# EAGLE board ShiftReg (EAGLE 8.5.1)
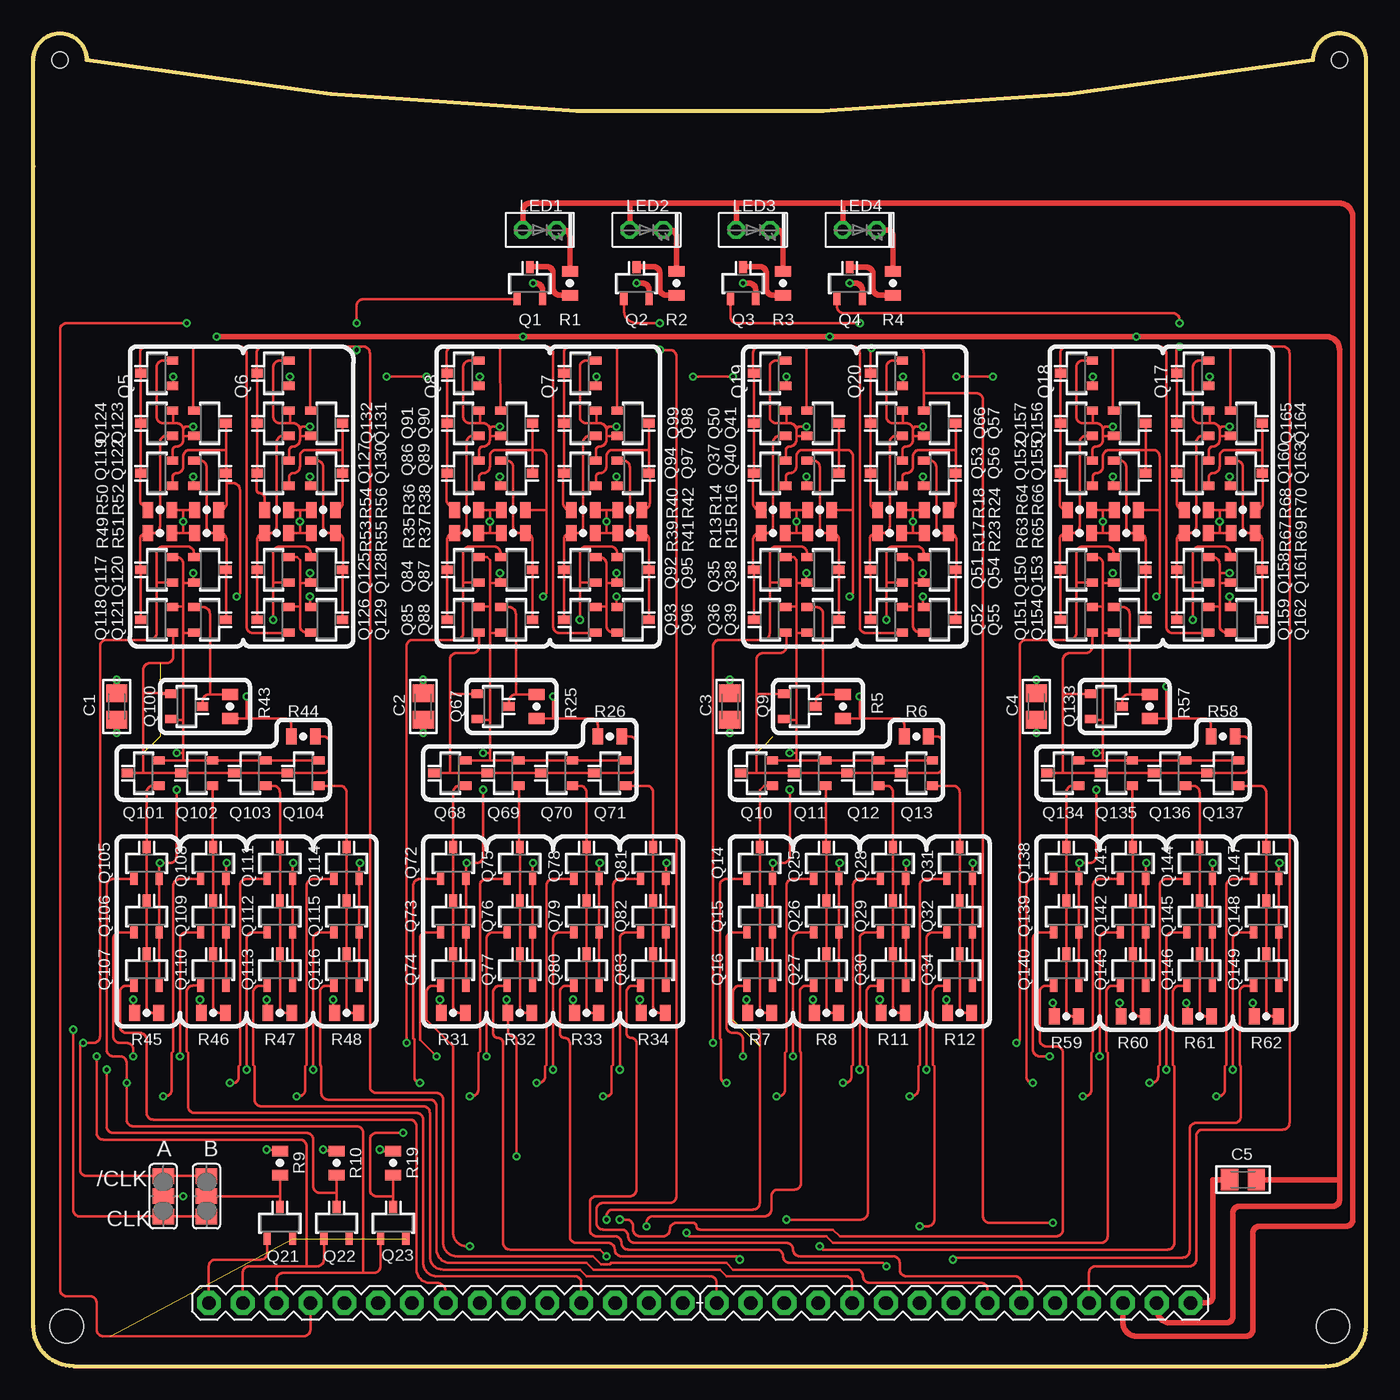
[diagram p2: board, top side]
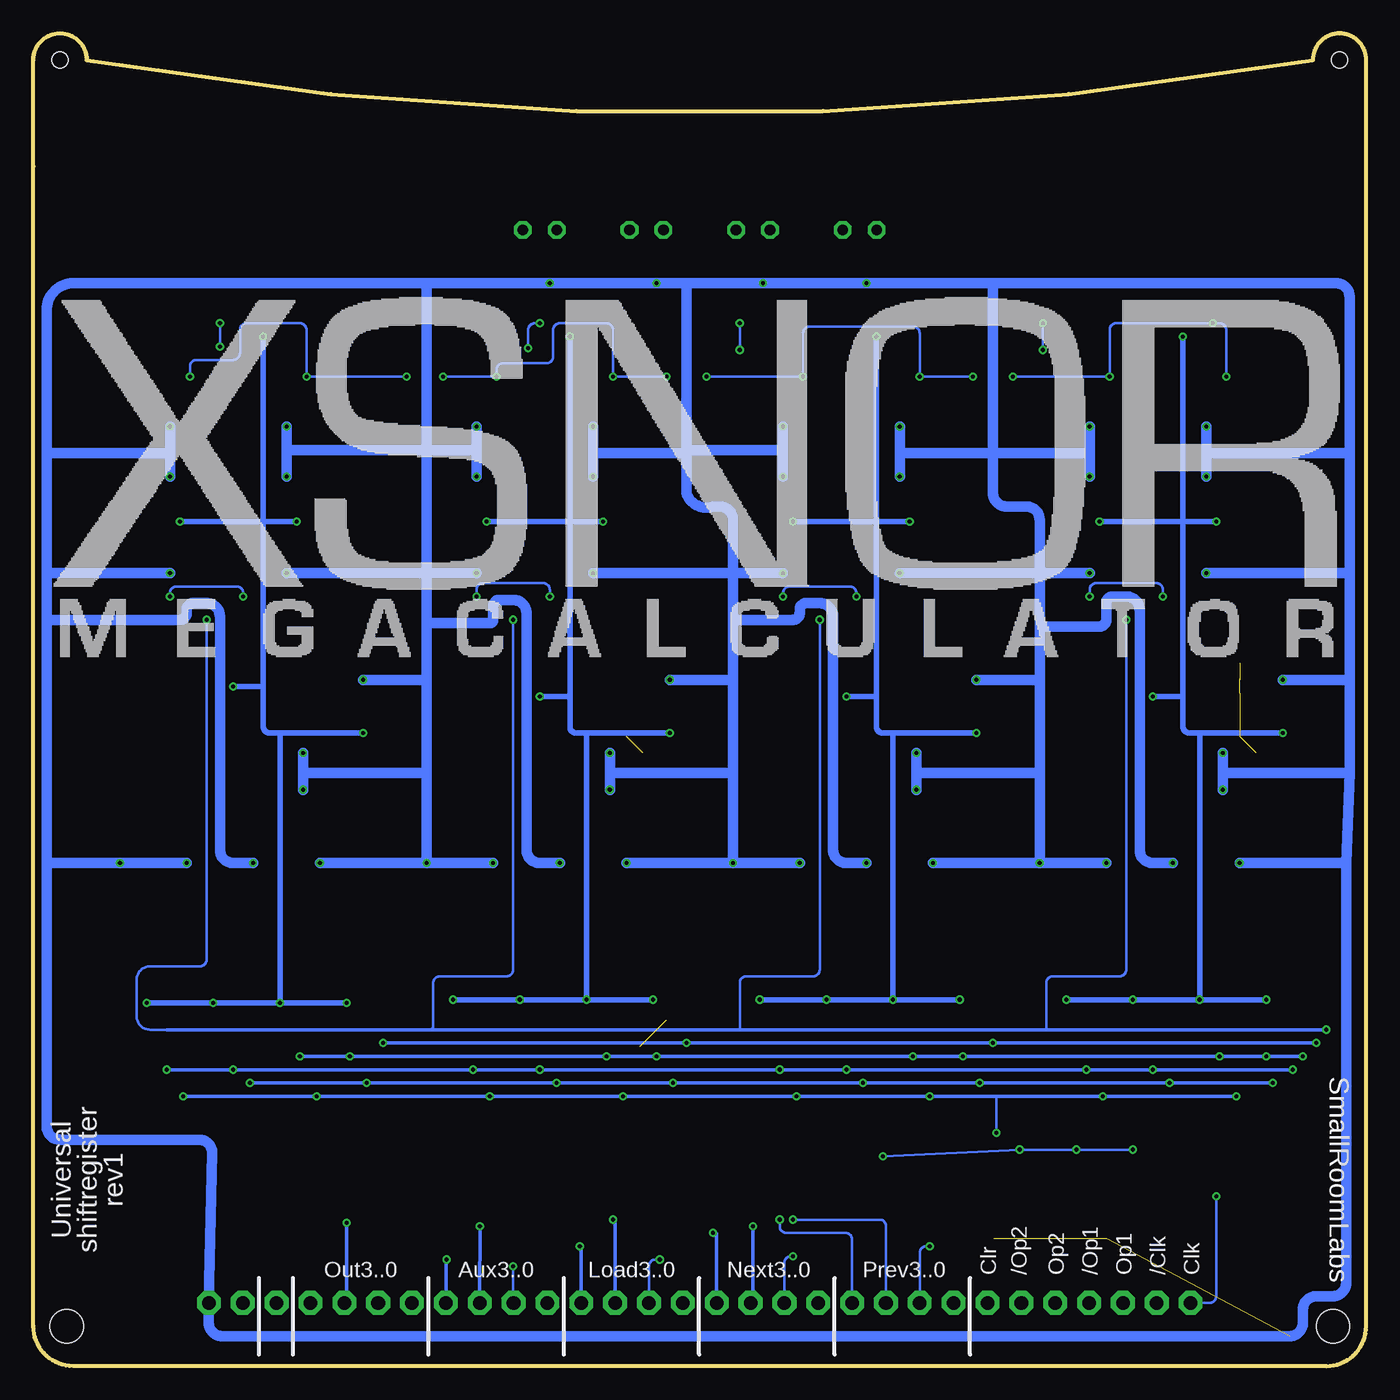
[diagram p3: board, bottom side, seen from below]

Size 100 x 100 mm. Coordinates in mm from the lower left corner, seen from the top.
Outline: 3,0 arc-90 0,3 0,90 0,98 arc-90 2,100 arc-90 4,98 arc20 96,98 arc-90 98,100 arc-90 100,98 100,90 100,3 arc-90 97,0 3,0
Copper layers (1*16): Top 0.035mm / dielectric 1.5mm / Bottom 0.035mm
Design rules "dirt_cheap_dirty_boards.v1": minimum track width 5mil, minimum drill 12mil, track to track 5mil, track to pad 5mil, pad to pad 5mil, via to via 5mil, smd to smd 0mil, copper to edge 10mil, drill to drill 10mil, minimum pad ring 10mil, minimum via ring 6mil, stop-mask expansion 2mil, vias tented up to drill 25mil, thermal gap 10mil
Net classes: 0 default: width 0.2 mm, drill 0.305 mm, clearance 0.2 mm
Holes 2.5 mm at 2.5,3 97.5,3
Holes 1.2 mm at 2,98 98,98

## Footprints (pad centres in the part's own frame; a part is rotated, then mirrored left to right if it is on the bottom)
C0805K = smd 1.3 x 1.6: 1 -1,0; 2 1,0
1X30 = drill 1.016 pad 1.778 octagon: 1 -36.83,0; 2 -34.29,0; 3 -31.75,0; 4 -29.21,0; 5 -26.67,0; 6 -24.13,0; 7 -21.59,0; 8 -19.05,0; 9 -16.51,0; 10 -13.97,0; 11 -11.43,0; 12 -8.89,0; 13 -6.35,0; 14 -3.81,0; 15 -1.27,0; 16 1.27,0; 17 3.81,0; 18 6.35,0; 19 8.89,0; 20 11.43,0; 21 13.97,0; 22 16.51,0; 23 19.05,0; 24 21.59,0; 25 24.13,0; 26 26.67,0; 27 29.21,0; 28 31.75,0; 29 34.29,0; 30 36.83,0
LED2X5 = drill 0.813 octagon: A -1.27,0; K 1.27,0
SOT23 = smd 0.6 x 0.9: 1 -0.95,-1.2; 2 0.95,-1.2 | smd 0.65 x 0.9: 3 0,1.2
0805 = smd 0.8 x 1.2: 1 -0.9,0; 2 0.9,0
SJ_2 = smd 1.168 x 1.6: 1 -1.524,0; 2 0,0; 3 1.524,0

## Placement (x,y rotation side)
C1  [C0805K]  6.25,49.5 90 top
C2  [C0805K]  29.25,49.5 90 top
C3  [C0805K]  52.25,49.5 90 top
C4  [C0805K]  75.25,49.5 90 top
C5  [C0805K]  90.75,14 180 top
JP2  [1X30]  50,4.75 0 top
LED1  [LED2X5]  38,85.25 0 top
LED2  [LED2X5]  46,85.25 0 top
LED3  [LED2X5]  54,85.25 0 top
LED4  [LED2X5]  62,85.25 0 top
Q1  [SOT23]  37.25,81.25 0 top
Q2  [SOT23]  45.25,81.25 0 top
Q3  [SOT23]  53.25,81.25 0 top
Q4  [SOT23]  61.25,81.25 0 top
Q5  310mA/60V/1.6Ω  [SOT23]  9.25,74.5 90 top
Q6  310mA/60V/1.6Ω  [SOT23]  18,74.5 90 top
Q7  310mA/60V/1.6Ω  [SOT23]  41,74.5 90 top
Q8  310mA/60V/1.6Ω  [SOT23]  32.25,74.5 90 top
Q9  310mA/60V/1.6Ω  [SOT23]  57.5,49.5 270 top
Q10  310mA/60V/1.6Ω  [SOT23]  54.25,44.5 90 top
Q11  310mA/60V/1.6Ω  [SOT23]  58.25,44.5 90 top
Q12  310mA/60V/1.6Ω  [SOT23]  62.25,44.5 90 top
Q13  310mA/60V/1.6Ω  [SOT23]  66.25,44.5 90 top
Q14  310mA/60V/1.6Ω  [SOT23]  54.5,37.75 0 top
Q15  310mA/60V/1.6Ω  [SOT23]  54.5,33.75 0 top
Q16  310mA/60V/1.6Ω  [SOT23]  54.5,29.75 0 top
Q17  310mA/60V/1.6Ω  [SOT23]  87,74.5 90 top
Q18  310mA/60V/1.6Ω  [SOT23]  78.25,74.5 90 top
Q19  310mA/60V/1.6Ω  [SOT23]  55.25,74.5 90 top
Q20  310mA/60V/1.6Ω  [SOT23]  64,74.5 90 top
Q21  310mA/60V/1.6Ω  [SOT23]  18.5,10.75 0 top
Q22  310mA/60V/1.6Ω  [SOT23]  22.75,10.75 0 top
Q23  310mA/60V/1.6Ω  [SOT23]  27,10.75 0 top
Q25  310mA/60V/1.6Ω  [SOT23]  59.5,37.75 0 top
Q26  310mA/60V/1.6Ω  [SOT23]  59.5,33.75 0 top
Q27  310mA/60V/1.6Ω  [SOT23]  59.5,29.75 0 top
Q28  310mA/60V/1.6Ω  [SOT23]  64.5,37.75 0 top
Q29  310mA/60V/1.6Ω  [SOT23]  64.5,33.75 0 top
Q30  310mA/60V/1.6Ω  [SOT23]  64.5,29.75 0 top
Q31  310mA/60V/1.6Ω  [SOT23]  69.5,37.75 0 top
Q32  310mA/60V/1.6Ω  [SOT23]  69.5,33.75 0 top
Q34  310mA/60V/1.6Ω  [SOT23]  69.5,29.75 0 top
Q35  310mA/60V/1.6Ω  [SOT23]  55.25,59.75 90 top
Q36  310mA/60V/1.6Ω  [SOT23]  55.25,56 90 top
Q37  310mA/60V/1.6Ω  [SOT23]  55.25,67 90 top
Q38  310mA/60V/1.6Ω  [SOT23]  59.25,59.75 270 top
Q39  310mA/60V/1.6Ω  [SOT23]  59.25,56 270 top
Q40  310mA/60V/1.6Ω  [SOT23]  59.25,67 270 top
Q41  310mA/60V/1.6Ω  [SOT23]  59.25,70.75 270 top
Q50  310mA/60V/1.6Ω  [SOT23]  55.25,70.75 90 top
Q51  310mA/60V/1.6Ω  [SOT23]  64,59.75 90 top
Q52  310mA/60V/1.6Ω  [SOT23]  64,56 90 top
Q53  310mA/60V/1.6Ω  [SOT23]  64,67 90 top
Q54  310mA/60V/1.6Ω  [SOT23]  68,59.75 270 top
Q55  310mA/60V/1.6Ω  [SOT23]  68,56 270 top
Q56  310mA/60V/1.6Ω  [SOT23]  68,67 270 top
Q57  310mA/60V/1.6Ω  [SOT23]  68,70.75 270 top
Q66  310mA/60V/1.6Ω  [SOT23]  64,70.75 90 top
Q67  310mA/60V/1.6Ω  [SOT23]  34.5,49.5 270 top
Q68  310mA/60V/1.6Ω  [SOT23]  31.25,44.5 90 top
Q69  310mA/60V/1.6Ω  [SOT23]  35.25,44.5 90 top
Q70  310mA/60V/1.6Ω  [SOT23]  39.25,44.5 90 top
Q71  310mA/60V/1.6Ω  [SOT23]  43.25,44.5 90 top
Q72  310mA/60V/1.6Ω  [SOT23]  31.5,37.75 0 top
Q73  310mA/60V/1.6Ω  [SOT23]  31.5,33.75 0 top
Q74  310mA/60V/1.6Ω  [SOT23]  31.5,29.75 0 top
Q75  310mA/60V/1.6Ω  [SOT23]  36.5,37.75 0 top
Q76  310mA/60V/1.6Ω  [SOT23]  36.5,33.75 0 top
Q77  310mA/60V/1.6Ω  [SOT23]  36.5,29.75 0 top
Q78  310mA/60V/1.6Ω  [SOT23]  41.5,37.75 0 top
Q79  310mA/60V/1.6Ω  [SOT23]  41.5,33.75 0 top
Q80  310mA/60V/1.6Ω  [SOT23]  41.5,29.75 0 top
Q81  310mA/60V/1.6Ω  [SOT23]  46.5,37.75 0 top
Q82  310mA/60V/1.6Ω  [SOT23]  46.5,33.75 0 top
Q83  310mA/60V/1.6Ω  [SOT23]  46.5,29.75 0 top
Q84  310mA/60V/1.6Ω  [SOT23]  32.25,59.75 90 top
Q85  310mA/60V/1.6Ω  [SOT23]  32.25,56 90 top
Q86  310mA/60V/1.6Ω  [SOT23]  32.25,67 90 top
Q87  310mA/60V/1.6Ω  [SOT23]  36.25,59.75 270 top
Q88  310mA/60V/1.6Ω  [SOT23]  36.25,56 270 top
Q89  310mA/60V/1.6Ω  [SOT23]  36.25,67 270 top
Q90  310mA/60V/1.6Ω  [SOT23]  36.25,70.75 270 top
Q91  310mA/60V/1.6Ω  [SOT23]  32.25,70.75 90 top
Q92  310mA/60V/1.6Ω  [SOT23]  41,59.75 90 top
Q93  310mA/60V/1.6Ω  [SOT23]  41,56 90 top
Q94  310mA/60V/1.6Ω  [SOT23]  41,67 90 top
Q95  310mA/60V/1.6Ω  [SOT23]  45,59.75 270 top
Q96  310mA/60V/1.6Ω  [SOT23]  45,56 270 top
Q97  310mA/60V/1.6Ω  [SOT23]  45,67 270 top
Q98  310mA/60V/1.6Ω  [SOT23]  45,70.75 270 top
Q99  310mA/60V/1.6Ω  [SOT23]  41,70.75 90 top
Q100  310mA/60V/1.6Ω  [SOT23]  11.5,49.5 270 top
Q101  310mA/60V/1.6Ω  [SOT23]  8.25,44.5 90 top
Q102  310mA/60V/1.6Ω  [SOT23]  12.25,44.5 90 top
Q103  310mA/60V/1.6Ω  [SOT23]  16.25,44.5 90 top
Q104  310mA/60V/1.6Ω  [SOT23]  20.25,44.5 90 top
Q105  310mA/60V/1.6Ω  [SOT23]  8.5,37.75 0 top
Q106  310mA/60V/1.6Ω  [SOT23]  8.5,33.75 0 top
Q107  310mA/60V/1.6Ω  [SOT23]  8.5,29.75 0 top
Q108  310mA/60V/1.6Ω  [SOT23]  13.5,37.75 0 top
Q109  310mA/60V/1.6Ω  [SOT23]  13.5,33.75 0 top
Q110  310mA/60V/1.6Ω  [SOT23]  13.5,29.75 0 top
Q111  310mA/60V/1.6Ω  [SOT23]  18.5,37.75 0 top
Q112  310mA/60V/1.6Ω  [SOT23]  18.5,33.75 0 top
Q113  310mA/60V/1.6Ω  [SOT23]  18.5,29.75 0 top
Q114  310mA/60V/1.6Ω  [SOT23]  23.5,37.75 0 top
Q115  310mA/60V/1.6Ω  [SOT23]  23.5,33.75 0 top
Q116  310mA/60V/1.6Ω  [SOT23]  23.5,29.75 0 top
Q117  310mA/60V/1.6Ω  [SOT23]  9.25,59.75 90 top
Q118  310mA/60V/1.6Ω  [SOT23]  9.25,56 90 top
Q119  310mA/60V/1.6Ω  [SOT23]  9.25,67 90 top
Q120  310mA/60V/1.6Ω  [SOT23]  13.25,59.75 270 top
Q121  310mA/60V/1.6Ω  [SOT23]  13.25,56 270 top
Q122  310mA/60V/1.6Ω  [SOT23]  13.25,67 270 top
Q123  310mA/60V/1.6Ω  [SOT23]  13.25,70.75 270 top
Q124  310mA/60V/1.6Ω  [SOT23]  9.25,70.75 90 top
Q125  310mA/60V/1.6Ω  [SOT23]  18,59.75 90 top
Q126  310mA/60V/1.6Ω  [SOT23]  18,56 90 top
Q127  310mA/60V/1.6Ω  [SOT23]  18,67 90 top
Q128  310mA/60V/1.6Ω  [SOT23]  22,59.75 270 top
Q129  310mA/60V/1.6Ω  [SOT23]  22,56 270 top
Q130  310mA/60V/1.6Ω  [SOT23]  22,67 270 top
Q131  310mA/60V/1.6Ω  [SOT23]  22,70.75 270 top
Q132  310mA/60V/1.6Ω  [SOT23]  18,70.75 90 top
Q133  310mA/60V/1.6Ω  [SOT23]  80.5,49.5 270 top
Q134  310mA/60V/1.6Ω  [SOT23]  77.25,44.5 90 top
Q135  310mA/60V/1.6Ω  [SOT23]  81.25,44.5 90 top
Q136  310mA/60V/1.6Ω  [SOT23]  85.25,44.5 90 top
Q137  310mA/60V/1.6Ω  [SOT23]  89.25,44.5 90 top
Q138  310mA/60V/1.6Ω  [SOT23]  77.5,37.75 0 top
Q139  310mA/60V/1.6Ω  [SOT23]  77.5,33.75 0 top
Q140  310mA/60V/1.6Ω  [SOT23]  77.5,29.75 0 top
Q141  310mA/60V/1.6Ω  [SOT23]  82.5,37.75 0 top
Q142  310mA/60V/1.6Ω  [SOT23]  82.5,33.75 0 top
Q143  310mA/60V/1.6Ω  [SOT23]  82.5,29.75 0 top
Q144  310mA/60V/1.6Ω  [SOT23]  87.5,37.75 0 top
Q145  310mA/60V/1.6Ω  [SOT23]  87.5,33.75 0 top
Q146  310mA/60V/1.6Ω  [SOT23]  87.5,29.75 0 top
Q147  310mA/60V/1.6Ω  [SOT23]  92.5,37.75 0 top
Q148  310mA/60V/1.6Ω  [SOT23]  92.5,33.75 0 top
Q149  310mA/60V/1.6Ω  [SOT23]  92.5,29.75 0 top
Q150  310mA/60V/1.6Ω  [SOT23]  78.25,59.75 90 top
Q151  310mA/60V/1.6Ω  [SOT23]  78.25,56 90 top
Q152  310mA/60V/1.6Ω  [SOT23]  78.25,67 90 top
Q153  310mA/60V/1.6Ω  [SOT23]  82.25,59.75 270 top
Q154  310mA/60V/1.6Ω  [SOT23]  82.25,56 270 top
Q155  310mA/60V/1.6Ω  [SOT23]  82.25,67 270 top
Q156  310mA/60V/1.6Ω  [SOT23]  82.25,70.75 270 top
Q157  310mA/60V/1.6Ω  [SOT23]  78.25,70.75 90 top
Q158  310mA/60V/1.6Ω  [SOT23]  87,59.75 90 top
Q159  310mA/60V/1.6Ω  [SOT23]  87,56 90 top
Q160  310mA/60V/1.6Ω  [SOT23]  87,67 90 top
Q161  310mA/60V/1.6Ω  [SOT23]  91,59.75 270 top
Q162  310mA/60V/1.6Ω  [SOT23]  91,56 270 top
Q163  310mA/60V/1.6Ω  [SOT23]  91,67 270 top
Q164  310mA/60V/1.6Ω  [SOT23]  91,70.75 270 top
Q165  310mA/60V/1.6Ω  [SOT23]  87,70.75 90 top
R1  [0805]  40.25,81.25 90 top
R2  [0805]  48.25,81.25 90 top
R3  [0805]  56.25,81.25 90 top
R4  [0805]  64.5,81.25 90 top
R5  [0805]  60.75,49.5 90 top
R6  [0805]  66.25,47.25 0 top
R7  [0805]  54.5,26.5 0 top
R8  [0805]  59.5,26.5 0 top
R9  [0805]  18.5,15.25 90 top
R10  [0805]  22.75,15.25 90 top
R11  [0805]  64.5,26.5 0 top
R12  [0805]  69.5,26.5 0 top
R13  [0805]  55.5,62.5 0 top
R14  [0805]  55.5,64.25 0 top
R15  [0805]  59,62.5 180 top
R16  [0805]  59,64.25 180 top
R17  [0805]  64.25,62.5 0 top
R18  [0805]  64.25,64.25 0 top
R19  [0805]  27,15.25 90 top
R23  [0805]  67.75,62.5 180 top
R24  [0805]  67.75,64.25 180 top
R25  [0805]  37.75,49.5 90 top
R26  [0805]  43.25,47.25 0 top
R31  [0805]  31.5,26.5 0 top
R32  [0805]  36.5,26.5 0 top
R33  [0805]  41.5,26.5 0 top
R34  [0805]  46.5,26.5 0 top
R35  [0805]  32.5,62.5 0 top
R36  [0805]  32.5,64.25 0 top
R37  [0805]  36,62.5 180 top
R38  [0805]  36,64.25 180 top
R39  [0805]  41.25,62.5 0 top
R40  [0805]  41.25,64.25 0 top
R41  [0805]  44.75,62.5 180 top
R42  [0805]  44.75,64.25 180 top
R43  [0805]  14.75,49.5 90 top
R44  [0805]  20.25,47.25 0 top
R45  [0805]  8.5,26.5 0 top
R46  [0805]  13.5,26.5 0 top
R47  [0805]  18.5,26.5 0 top
R48  [0805]  23.5,26.5 0 top
R49  [0805]  9.5,62.5 0 top
R50  [0805]  9.5,64.25 0 top
R51  [0805]  13,62.5 180 top
R52  [0805]  13,64.25 180 top
R53  [0805]  18.25,62.5 0 top
R54  [0805]  18.25,64.25 0 top
R55  [0805]  21.75,62.5 180 top
R56  [0805]  21.75,64.25 180 top
R57  [0805]  83.75,49.5 90 top
R58  [0805]  89.25,47.25 0 top
R59  [0805]  77.5,26.25 0 top
R60  [0805]  82.5,26.25 0 top
R61  [0805]  87.5,26.25 0 top
R62  [0805]  92.5,26.25 0 top
R63  [0805]  78.5,62.5 0 top
R64  [0805]  78.5,64.25 0 top
R65  [0805]  82,62.5 180 top
R66  [0805]  82,64.25 180 top
R67  [0805]  87.25,62.5 0 top
R68  [0805]  87.25,64.25 0 top
R69  [0805]  90.75,62.5 180 top
R70  [0805]  90.75,64.25 180 top
SJ1  [SJ_2]  13,12.75 90 top
SJ2  [SJ_2]  9.75,12.75 90 top

## Tracks (layer width: path | path; a pad name or v marks a point on that pad's centre or on a via)
/CLK  (via drill 0.3)
  Top 0.2: 74,25.49 74,25.25 | 78.25,58.8 Q150.1 | 55.25,58.8 Q35.1 | 32.25,58.8 Q84.1 | 9.25,58.8 Q117.1 | 32.25,58.8 32.25,61 arc-90 32.75,61.5 34.55,61.5 arc-90 35.05,61 Q87.1 | Q38.1 58.05,61 arc90 57.55,61.5 55.75,61.5 arc90 55.25,61 55.25,58.8 | Q153.1 81.05,61 arc90 80.55,61.5 78.75,61.5 arc90 78.25,61 78.25,58.8 | 9.25,58.8 9.25,61 arc-90 9.75,61.5 11.55,61.5 arc-90 12.05,61 Q120.1 | 9.25,58.8 9.25,55 arc-90 8.75,54.5 5.5,54.5 arc90 5,54 5,24.75 arc-90 4.5,24.25 v3.75,24.25 arc90 3.5,24 3.5,14.77 arc90 4,14.27 SJ2.3 SJ1.3 | v28,24.25 28,54 arc-90 28.5,54.5 31.75,54.5 arc90 32.25,55 32.25,58.8 | v51,24.25 51,54 arc-90 51.5,54.5 54.75,54.5 arc90 55.25,55 55.25,58.8 | 74,25.25 74,54 arc-90 74.5,54.5 77.75,54.5 arc90 78.25,55 78.25,58.8 | 74,25.25 74,24.5 arc-90 v73.75,24.25
  Bottom 0.25: v3.75,24.25 v28,24.25 v51,24.25 v73.75,24.25
/OP1  (via drill 0.3)
  Top 0.2: 67,23.75 67,23.5 | 67,23.75 v67,22.25 | 85,25.64 85,25.5 | 85,25.5 v85,22.25 | v90,22.25 90,25.72 90,24.25 | 90,24.25 90,24.5 | 85,24.25 85,24.5 | 85,25.5 85,24.25 | Q79.1 40.5,32.55 39.5,32.55 arc90 39,32.05 v39,22.25 | Q115.1 22.51,32.55 21.5,32.55 arc90 21,32.05 v21,22.25 | Q112.1 16.5,32.55 arc90 16,32.05 v16,22.25 | Q82.1 44.5,32.55 arc90 44,32.05 v44,22.25 | Q29.1 62.5,32.55 arc90 62,32.05 v62,22.25 | Q32.1 67.5,32.55 arc90 67,32.05 67,23.75 | Q145.1 85.5,32.55 arc90 85,32.05 85,24.25 | Q148.1 90.5,32.55 arc90 90,32.05 90,24.25 | Q22.3 22.75,13 | 22.75,13 R10.1 | v5.5,22.25 5.5,18 arc90 6,17.5 20.5,17.5 arc-90 21,17 21,13.5 arc90 21.5,13 22.75,13
  Bottom 0.25: v5.5,22.25 v16,22.25 v21,22.25 v39,22.25 v44,22.25 v62,22.25 v67,22.25 81.5,22.25 v85,22.25 v90,22.25
/OP2  (via drill 0.3)
  Top 0.2: Q25.1 58.5,36.55 57,36.55 arc90 56.5,36.05 56.5,23.61 56.4,23.5 56.4,23 | Q108.1 11,36.55 arc90 10.5,36.05 10.5,23.61 10.39,23.5 10.39,20.75 arc-90 9.89,20.25 v9.75,20.25 | Q81.1 44,36.55 arc90 43.5,36.05 43.5,22.61 43.4,22.5 43.4,20.64 arc-90 43,20.25 v42.75,20.25 | Q31.1 67,36.55 arc90 66.5,36.05 66.5,22.61 66.39,22.5 66.39,22 | Q141.1 80,36.55 arc90 79.5,36.05 79.5,23.61 79.39,23.5 79.39,23 | Q147.1 90,36.55 arc90 89.5,36.05 89.5,22.61 89.39,22.5 89.39,22 | 33.5,35.5 33.5,34.75 | 33.5,34.75 33.5,23.61 33.4,23.5 33.4,20.75 arc-90 32.9,20.25 v32.75,20.25 | Q75.1 34,36.55 arc90 33.5,36.05 33.5,34.75 | Q23.3 27,12.75 | 27,12.75 27,13 R19.1 | 27,12.75 25.75,12.75 arc-90 25.25,13.25 25.25,17 arc-90 25.75,17.5 v27.75,17.5 | v19.75,20.25 19.89,20.25 arc90 20.39,20.75 20.39,22.5 20.5,22.61 20.5,36.05 arc-90 21,36.55 Q114.1 | 56.4,23 | 56.4,23 56.4,20.75 arc-90 55.9,20.25 v55.75,20.25 | 66.39,22 | 66.39,22 66.39,20.75 arc-90 65.89,20.25 v65.75,20.25 | 79.39,23 | 79.39,23 79.39,20.75 arc-90 78.89,20.25 v78.75,20.25 | 89.39,22 | 89.39,22 89.39,20.75 arc-90 88.89,20.25 v88.75,20.25
  Bottom 0.2: v27.75,17.5 27.75,20 27.75,20.25
  Bottom 0.25: v9.75,20.25 v19.75,20.25 27.75,20.25 v32.75,20.25 v42.75,20.25 v55.75,20.25 v65.75,20.25 v78.75,20.25 v88.75,20.25
AUX0
  Top 0.2: JP2.20 61.43,6.25 arc90 60.93,6.75 52,6.75 51.5,7.25 43.46,7.25 43.43,7.21 42.03,7.21 41.5,7.75 31.25,7.75 arc-90 30.25,8.75 30.25,12.25 | Q116.1 22,28.55 arc90 21.5,28.05 21.5,22.61 21.61,22.5 21.61,20.5 arc90 22.11,20 29.75,20 arc-90 30.25,19.5 30.25,12.25 | 30.25,13.25 30.25,12.25
AUX0A'
  Top 0.2: R48.2 24,26.5 arc-90 23.5,27 Q116.3 Q115.3 Q114.3 23.5,43.05 arc90 23,43.55 Q104.1
AUX1  (via drill 0.3)
  Top 0.2: v64,7.5 63.75,7.75 58.25,7.75 56.75,7.75 arc-90 56.25,8.25 arc90 55.75,8.75 44.62,8.75 arc-90 44.12,9.25 arc90 43.62,9.75 42.25,9.75 arc-90 41.75,10.25 41.75,12.25 arc-90 42.25,12.75 44.75,12.75 arc90 45.25,13.25 45.25,24.25 arc90 44.88,24.62 arc-90 44.5,25 44.5,28.05 arc-90 45,28.55 Q83.1
  Bottom 0.2: v64,7.5 64,4.78 JP2.21
AUX1A'-
  Top 0.2: Q71.1 46,43.55 arc-90 46.5,43.05 Q81.3 Q82.3 Q83.3 46.5,27 arc90 47,26.5 R34.2
AUX2  (via drill 0.3)
  Top 0.2: 67.61,22 67.61,22.5 67.5,22.61 67.5,28.05 arc-90 68,28.55 Q34.1 | 67.61,22 | 67.61,22 67.61,11 arc-90 67.11,10.5 v66.5,10.5
  Bottom 0.25: JP2.22 66.51,5.24 v66.5,10.5
AUX2A'
  Top 0.2: Q13.1 69,43.55 arc-90 69.5,43.05 Q31.3 Q32.3 Q34.3 69.5,27 arc90 70,26.5 R12.2
AUX3  (via drill 0.3)
  Top 0.2: Q149.1 91,28.55 arc90 90.5,28.05 90.5,22.61 90.61,22.5 90.61,22 | 90.61,22 | v69,8 arc-90 69.15,8.15 86.25,8.15 arc90 86.75,8.65 86.75,17.75 arc-90 87.25,18.25 90.11,18.25 arc90 90.61,18.75 90.61,22
  Bottom 0.25: v69,8 69.05,8.2 JP2.23
AUX3A'
  Top 0.2: Q137.1 92,43.55 arc-90 92.5,43.05 Q147.3 Q148.3 Q149.3 92.5,26.75 arc90 93,26.25 R62.2
CLK  (via drill 0.3)
  Top 0.2: 87,58.8 Q158.1 | 87,58.8 v87,56 | 64,58.8 Q51.1 | 64,58.8 v64,56 | 41,58.8 Q92.1 | 41,58.8 v41,56 | 18,58.8 Q125.1 | 18,58.8 v18,56 | Q95.1 43.8,61 arc90 43.3,61.5 41.5,61.5 arc90 41,61 41,58.8 | Q54.1 66.8,61 arc90 66.3,61.5 64.5,61.5 arc90 64,61 64,58.8 | 87,58.8 87,61 arc-90 87.5,61.5 89.3,61.5 arc-90 89.8,61 Q161.1 | SJ1.1 SJ2.1 3.5,11.23 arc-90 3,11.73 v3,25.25 | 18,58.8 18,61 arc-90 18.5,61.5 20.3,61.5 arc-90 20.8,61 Q128.1
  Bottom 0.2: v18,56 18,29.75 arc90 18.5,29.25 23.5,29.25 arc-90 24,28.75 24,26 | 24,26 24,25.25 24,26 | v41,56 41,29.75 arc90 41.5,29.25 46.5,29.25 arc-90 47,28.75 47,25.25 | v64,56 64,29.75 arc90 64.5,29.25 69.5,29.25 arc-90 70,28.75 70,25.75 | 70,25.75 70,25.25 | v87,56 87,30.5 arc90 87.5,30 89.75,30 91.25,30 arc-90 92.25,29 92.25,26.25 arc-90 91.25,25.25 85.25,25.25 | 70,25.75 70,25.5 arc90 70.25,25.25
  Bottom 0.25: v3,25.25 24,25.25 47,25.25 70,25.25 70.25,25.25 85.25,25.25 90,25.25
CLK_IN  (via drill 0.3)
  Top 0.2: JP2.1 13.17,7.5 arc-90 13.67,8 17.05,8 arc90 17.55,8.5 Q21.1 | v11.25,12.75 SJ2.2
  Bottom 0.2: JP2.1 11.75,4.75 arc-90 11.25,5.25 v11.25,12.75
CLR  (via drill 0.3)
  Top 0.2: Q17.1 arc90 88.25,73.6 v88.25,74.25 | v79.5,74.25 79.5,73.6 arc-90 Q18.1 | Q20.1 arc90 65.25,73.6 v65.25,74.25 | v56.5,74.25 56.5,73.6 arc-90 Q19.1 | Q7.1 42.2,74.2 arc-90 v42.25,74.25 | v33.5,74.25 33.5,73.6 arc-90 Q8.1 | Q6.1 arc90 19.25,73.6 v19.25,74.25 | v10.5,74.25 10.5,73.6 arc-90 Q5.1 | v49.5,74.25 v52.5,74.25 | v69.25,74.25 v72,74.25 | v26.5,74.25 v29.5,74.25 | v11.5,78.25 2.5,78.25 arc90 2,77.75 2,5.75 arc90 2.5,5.25 4.25,5.25 arc-90 4.75,4.75 4.75,2.75 arc90 5.25,2.25 20.29,2.25 arc90 20.79,2.75 JP2.4
  Bottom 0.2: v88.25,74.25 88.25,75 arc90 87.75,75.5 85,75.5 arc-90 84.5,76 84.5,77.75 arc90 84,78.25 80,78.25 arc90 79.5,77.75 v79.5,74.25 v72,74.25 | v10.5,74.25 10.5,77.75 arc-90 11,78.25 v11.5,78.25 18.75,78.25 arc-90 19.25,77.75 v19.25,74.25 v26.5,74.25 | v49.5,74.25 v42.25,74.25 42.25,77.5 arc90 41.75,78 34,78 arc90 33.5,77.5 v33.5,74.25 v29.5,74.25 | v52.5,74.25 v56.5,74.25 56.5,77.75 arc-90 57,78.25 60.5,78.25 arc-90 61,77.75 61,75.75 arc90 61.5,75.25 64.75,75.25 arc-90 65.25,74.75 v65.25,74.25 v69.25,74.25
GND  (via drill 0.3)  (3 unrouted)
  Top 0.2: C4.2 v75.25,51.5 | Q134.2 80.25,45.45 | 80.25,45.45 Q135.2 Q136.2 Q137.2 | 80.25,48.5 80.25,46 | 80.25,46 80.25,45.45 | 80.25,58.75 80.25,57 | 80.25,58.75 81,58.75 Q153.2 81,58.85 | Q151.2 79.5,57 80.25,57 | 79.5,68 Q152.2 79.45,68.7 arc-90 79.75,69 arc90 80.25,69.5 80.25,69.75 | 80.25,55 80.25,57 | Q155.2 81,66.1 v81,66.75 | 81,69.85 Q156.2 80.3,69.8 arc90 80.25,69.75 | 89,58.75 89,57 | 89,58.75 89.75,58.75 Q161.2 89.75,58.85 | Q159.2 88.25,57 89,57 | Q163.2 89.75,66.1 v89.75,66.75 | 89.75,69.85 Q164.2 89.05,69.8 arc90 89,69.75 | Q154.2 81,55 80.25,55 | Q133.2 79.35,48.5 80.25,48.5 | 80.25,48.5 80.25,55 | Q140.2 Q139.2 Q138.2 78.45,37.7 v78.5,37.75 79.25,37.75 arc90 79.75,38.25 v79.75,43.25 | Q143.2 Q142.2 Q141.2 83.45,37.7 v83.5,37.75 | Q146.2 Q145.2 Q144.2 88.45,37.7 v88.5,37.75 | Q149.2 Q148.2 Q147.2 93.45,37.7 v93.5,37.75 | v79.75,46 80.25,46 | Q10.2 57.25,45.45 | 57.25,45.45 Q11.2 Q12.2 Q13.2 | 57.25,48.5 57.25,46 | 57.25,46 57.25,45.45 | 57.25,58.75 57.25,57 | 57.25,58.75 58,58.75 Q38.2 58,58.85 v58,59.5 | Q36.2 56.5,57 57.25,57 | 57.25,58.75 57.25,60.5 57.05,60.7 Q35.2 | 57.25,69.75 57.3,69.8 Q41.2 58,69.85 | 57.25,55 57.25,57 | Q40.2 58,66.1 v58,66.75 | 66,58.75 66,57 | 66,58.75 66.75,58.75 Q54.2 66.75,58.85 v66.75,59.5 | Q52.2 65.25,57 66,57 | 65.25,68 Q53.2 65.2,68.7 arc-90 65.5,69 arc90 66,69.5 66,69.75 | Q56.2 66.75,66.1 v66.75,66.75 | 66.75,69.85 Q57.2 66.05,69.8 arc90 66,69.75 | Q39.2 58,55 57.25,55 | Q9.2 56.35,48.5 57.25,48.5 | 57.25,48.5 57.25,55 | Q16.2 Q15.2 Q14.2 55.45,37.7 v55.5,37.75 56.25,37.75 arc90 56.75,38.25 v56.75,43.25 | Q27.2 Q26.2 Q25.2 60.45,37.7 v60.5,37.75 | Q30.2 Q29.2 Q28.2 65.45,37.7 v65.5,37.75
  Top 0.2: Q34.2 Q32.2 Q31.2 70.45,37.7 v70.5,37.75 | v56.75,46 57.25,46 | Q68.2 34.25,45.45 | 34.25,45.45 Q69.2 Q70.2 Q71.2 | 34.25,48.5 34.25,46 | 34.25,46 34.25,45.45 | 34.25,58.75 34.25,57 | 34.25,58.75 35,58.75 Q87.2 35,58.85 v35,59.5 | Q85.2 33.5,57 34.25,57 | 34.25,58.75 34.25,60.5 34.05,60.7 Q84.2 | 33.5,68 Q86.2 33.45,68.7 arc-90 33.75,69 arc90 34.25,69.5 34.25,69.75 | 34.25,55 34.25,57 | Q89.2 35,66.1 v35,66.75 | 35,69.85 Q90.2 34.3,69.8 arc90 34.25,69.75 | 43,58.75 43,57 | 43,58.75 43.75,58.75 Q95.2 43.75,58.85 v43.75,59.5 | Q93.2 42.25,57 43,57 | 42.25,68 Q94.2 42.2,68.7 arc-90 42.5,69 arc90 43,69.5 43,69.75 | Q97.2 43.75,66.1 v43.75,66.75 | 43.75,70 43.75,69.85 Q98.2 43.05,69.8 arc90 43,69.75 | Q88.2 35,55 34.25,55 | Q67.2 33.35,48.5 34.25,48.5 | 34.25,48.5 34.25,55 | Q74.2 Q73.2 Q72.2 32.45,37.7 v32.5,37.75 33.25,37.75 arc90 33.75,38.25 v33.75,43.25 | Q77.2 Q76.2 Q75.2 37.45,37.7 v37.5,37.75 | Q80.2 Q79.2 Q78.2 42.45,37.7 v42.5,37.75 | Q83.2 Q82.2 Q81.2 47.45,37.7 v47.5,37.75 | v33.75,46 34.25,46 | Q101.2 11.25,45.45 | 11.25,45.45 Q102.2 Q103.2 Q104.2 | 11.25,48.5 11.25,46 | 11.25,46 11.25,45.45 | 11.25,58.75 11.25,57 | 11.25,58.75 12,58.75 Q120.2 12,58.85 v12,59.5 | Q118.2 10.5,57 11.25,57 | 10.5,68 Q119.2 10.45,68.7 arc-90 10.75,69 arc90 11.25,69.5 11.25,69.75 | 11.25,55 11.25,57 | Q122.2 12,66.1 v12,66.75 | 12,69.85 Q123.2 11.3,69.8 arc90 11.25,69.75 | Q129.2 20.5,55.05 arc-90 20,55.55 20,57 | 20,58.75 20,57 | 20,58.75 20.75,58.75 Q128.2 20.75,58.85 v20.75,59.5 | Q126.2 19.25,57 20,57 | 20,58.75 20,60.5 19.8,60.7 Q125.2 | 19.25,68 Q127.2 19.2,68.7 arc-90 19.5,69 arc90 20,69.5 20,69.75 | Q130.2 20.75,66.1 v20.75,66.75
  Top 0.2: 20.75,69.85 Q131.2 20.05,69.8 arc90 20,69.75 | Q121.2 12,55 11.25,55 | Q100.2 10.35,48.5 11.25,48.5 | 11.25,48.5 11.25,55 | Q107.2 Q106.2 Q105.2 9.45,37.7 v9.5,37.75 10.25,37.75 arc90 10.75,38.25 v10.75,43.25 | Q110.2 Q109.2 Q108.2 14.45,37.7 v14.5,37.75 | Q113.2 Q112.2 Q111.2 19.45,37.7 v19.5,37.75 | Q116.2 Q115.2 Q114.2 24.45,37.7 v24.5,37.75 | v10.75,46 11.25,46 | Q96.2 43.5,55.05 arc-90 43,55.55 43,57 | Q92.2 42.5,60.7 arc-90 43,60.2 43,58.75 | Q55.2 66.5,55.05 arc-90 66,55.55 66,57 | Q51.2 65.5,60.7 arc-90 66,60.2 66,58.75 | Q162.2 89.5,55.05 arc-90 89,55.55 89,57 | 11.25,58.75 11.25,60.2 arc90 10.75,60.7 Q117.2 | Q5.2 9.75,75.45 arc90 9.25,74.95 9.25,71.75 9.25,71.25 arc90 9.75,70.75 10.5,70.75 | Q6.2 18.5,75.45 arc90 18,74.95 18,71.25 arc90 18.5,70.75 19.25,70.75 | Q8.2 32.75,75.45 arc90 32.25,74.95 32.25,71.5 32.25,71.25 arc90 32.75,70.75 33.5,70.75 | Q7.2 41.5,75.45 arc90 41,74.95 41,71.5 41,71.25 arc90 41.5,70.75 42.25,70.75 | Q18.2 78.75,75.45 arc90 78.25,74.95 78.25,71.25 arc90 78.75,70.75 79.5,70.75 | Q17.2 87.5,75.45 arc90 87,74.95 87,72.25 | 87,72.25 87,72 | Q20.2 64.5,75.45 arc90 64,74.95 64,72 64,71.25 arc90 64.5,70.75 65.25,70.75 | Q19.2 55.75,75.45 arc90 55.25,74.95 55.25,71.5 | 55.25,71.5 55.25,71.25 | Q158.2 88.5,60.7 arc-90 89,60.2 89,59.5 | 89,59.5 89,58.75 | v89.75,59.5 89,59.5 | Q150.2 79.75,60.7 arc-90 80.25,60.2 80.25,58.75 | Q37.2 56.45,68.7 arc-90 56.75,69 arc90 57.25,69.5 57.25,69.75 | 57.25,70.25 arc90 56.75,70.75 56.5,70.75 | 55.25,71.25 arc90 55.75,70.75 56.5,70.75 | 55.25,71.25 55.25,71.5 | 57.25,70.25 57.25,69.75 | v58,70.5 57.5,70.5 arc90 57.25,70.25
  Top 0.2: Q50.2 arc-90 56.5,71.65 56.5,70.75 | 43,69.75 43,70.25 | 43,70.25 arc90 42.5,70.75 42.25,70.75 | Q99.2 arc-90 42.25,71.65 42.25,70.75 | v43.75,70.5 43.25,70.5 arc90 43,70.25 | 34.25,70.25 arc90 33.75,70.75 33.5,70.75 | 34.25,69.75 34.25,70.25 | Q91.2 arc-90 33.5,71.65 33.5,70.75 | v35,70.5 34.5,70.5 arc90 34.25,70.25 | 20,70.25 arc90 19.5,70.75 19.25,70.75 | 20,69.75 20,70.25 | Q132.2 arc-90 19.25,71.65 19.25,70.75 | v20.75,70.5 20.25,70.5 arc90 20,70.25 | 11.25,70.25 arc90 10.75,70.75 10.5,70.75 | 10.5,70.75 10.25,70.75 | 11.25,69.75 11.25,70.25 | Q124.2 arc-90 10.5,71.65 10.5,70.75 | v12,70.5 11.5,70.5 arc90 11.25,70.25 | 66,70.25 arc90 65.5,70.75 65.25,70.75 | 66,69.75 66,70.25 | Q66.2 arc-90 65.25,71.65 65.25,70.75 | v66.75,70.5 66.25,70.5 arc90 66,70.25 | Q160.2 88.2,68.7 arc-90 88.5,69 arc90 89,69.5 89,69.75 | 89,70.25 arc90 88.5,70.75 88.25,70.75 | 87,72.25 87,71.25 arc90 87.5,70.75 88.25,70.75 | 89,69.75 89,70.25 | Q165.2 arc-90 88.25,71.65 88.25,70.75 | v89.75,70.5 89.25,70.5 arc90 89,70.25 | 80.25,69.75 80.25,70.25 | 80.25,70.25 arc90 79.75,70.75 79.5,70.75 | Q157.2 arc-90 79.5,71.65 79.5,70.75 | v81,70.5 80.5,70.5 arc90 80.25,70.25
  Top 0.4: Q3.2 54.2,80.75 arc90 53.7,81.25 v53.25,81.25 | Q4.2 62.2,80.75 arc90 61.7,81.25 v61.25,81.25 | Q2.2 46.2,80.75 arc90 45.7,81.25 v45.25,81.25 | Q1.2 38.2,80.75 arc90 37.7,81.25 v37.5,81.25 | JP2.30 88,4.75 arc90 88.5,5.25 88.5,14 C5.2
  Top 0.5: C3.2 v52.25,51.5 | C2.2 v29.25,51.5 | C1.2 v6.25,51.5
  Bottom 0.8: 70.5,81.25 97,81.25 arc-90 99,79.25 99,68.5 | 70.5,81.25 v61.25,81.25 v53.25,81.25 51,81.25 | 51,81.25 v45.25,81.25 v37.5,81.25 37,81.25 28,81.25 | 1.25,68.5 1.25,59.5 | 1.25,59.5 1.25,51.5 | 1.25,51.5 1.25,44.5 | 1.25,44.5 1.5,37.75 | 99,37.75 99,56 | 99,56 99,59.5 | 99,59.5 99,68.5 | v89.75,70.5 89.75,68.5 | 89.75,68.5 v89.75,66.75 | 89.75,68.5 99,68.5 | v89.75,59.5 99,59.5 | v88.5,37.75 v93.5,37.75 99,37.75 | v65.5,37.75 v70.5,37.75 | v70.5,37.75 v78.5,37.75 | v70.5,37.75 70.5,44.5 | 70.5,44.5 70.5,51.75 | 70.5,51.75 70.5,55.75 | 70.5,55.75 70.5,59.5 | 70.5,59.5 70.5,68.5 | 70.5,68.5 70.5,81.25 | v66.75,66.75 66.75,68.75 | 66.75,68.75 v66.75,70.5 | 66.75,68.75 70.25,68.75 arc-90 70.5,68.5 | v81,70.5 81,68.75 | 81,68.75 v81,66.75 | 81,68.75 70.75,68.75 arc90 70.5,68.5 | v66.75,59.5 70.5,59.5 | v81,59.5 70.5,59.5 | v75.25,51.5 70.75,51.5 arc-90 70.5,51.75 | v79.75,46 79.75,44.75 | 79.75,44.75 v79.75,43.25 | 79.75,44.75 arc-90 79.5,44.5 70.5,44.5 | v42.5,37.75 v47.5,37.75 | v47.5,37.75 v55.5,37.75 | v47.5,37.75 47.5,44.75 | 47.5,44.75 47.5,51.5 | 47.5,51.5 47.5,56 | 47.5,56 47.5,59.5 | 51,68.5 51,81.25 | v58,70.5 58,68.5 | 58,68.5 v58,66.75 | v43.75,70.5 43.75,68.75 | 43.75,68.75 v43.75,66.75 | 43.75,68.75 50.75,68.75 arc-90 51,68.5 | 51,68.5 58,68.5 | v58,59.5 47.5,59.5 | 47.5,59.5 v43.75,59.5 | v52.25,51.5 47.5,51.5 | v56.75,46 56.75,44.5 | 56.75,44.5 v56.75,43.25 | 56.75,44.5 47.75,44.5 arc-90 47.5,44.75 | v19.5,37.75 v24.5,37.75 | v24.5,37.75 v32.5,37.75 | v24.5,37.75 24.5,44.5 | 24.5,44.5 24.5,51.25 | 24.5,51.25 24.5,55.5 | 24.5,55.5 24.5,59.5 | 28,68.5 28,81.25 | v35,70.5 35,68.5 | 35,68.5 v35,66.75 | 35,68.5 28,68.5 | v20.75,70.5 20.75,68.5 | 20.75,68.5 v20.75,66.75
  Bottom 0.8: 20.75,68.5 28,68.5 | v29.25,51.5 24.75,51.5 arc90 24.5,51.25 | v20.75,59.5 24.5,59.5 | v35,59.5 24.5,59.5 | v33.75,46 33.75,44.5 | 33.75,44.5 v33.75,43.25 | 33.75,44.5 24.5,44.5 | v12,70.5 12,68.75 | 12,68.75 v12,66.75 | 12,68.75 arc-90 11.75,68.5 1.25,68.5 | v12,59.5 1.25,59.5 | v10.75,46 10.75,44.5 | 10.75,44.5 v10.75,43.25 | 10.75,44.5 1.25,44.5 | v9.5,37.75 1.5,37.75 | 47.5,56 43,56 arc-90 42.5,56.5 42.5,56.75 arc90 42,57.25 41,57.25 arc90 40,56.25 40,38.75 arc-90 39,37.75 v37.5,37.75 | 70.5,55.75 65.75,55.75 arc-90 65.5,56 65.5,57 arc90 65,57.5 64,57.5 arc90 63,56.5 63,38.75 arc-90 62,37.75 v60.5,37.75 | 99,56 89,56 arc-90 88.5,56.5 88.5,56.75 arc90 88,57.25 87,57.25 arc90 86,56.25 86,38.75 arc-90 85,37.75 v83.5,37.75 | 24.5,55.5 20,55.5 arc-90 19.5,56 19.5,57.25 arc90 19,57.75 18,57.75 arc90 17,56.75 17,38.75 arc-90 16,37.75 v14.5,37.75 | v6.25,51.5 1.25,51.5 | 24.5,59.5 24.5,63.5 arc-90 25.5,64.5 27,64.5 arc90 28,65.5 28,68.5 | 47.5,59.5 47.5,63.5 arc-90 48.5,64.5 49,64.5 arc90 51,65.5 51,68.5 | 1.25,68.5 1.25,80.25 arc-90 2.25,81.25 28,81.25 | 99,37.75 99,18 arc-90 98,17 87.58,17 arc90 86.58,16 JP2.30 86.83,3.25 arc-90 85.83,2.25 5.75,2.25 arc-90 4.75,3.25 4.75,4.25 arc90 3.75,5.25 2.5,5.25 arc-90 1.5,6.25 1.5,37.75
LED+
  Top 0.4: 60.75,87.25 55.5,87.25 52.75,87.25 | 52.75,87.25 44.75,87.25 | LED2.A 44.75,86.27 44.75,87.25 | LED4.A 60.75,86.27 60.75,87.25 | LED3.A 52.75,85.27 52.75,87.25 | 60.75,87.25 65.25,87.25 | 65.25,87.25 65.5,87.25 | JP2.28 81.75,3.25 arc90 82.75,2.25 91,2.25 arc90 91.5,2.75 91.5,10 arc-90 92,10.5 98.5,10.5 arc90 99,11 99,86.25 arc90 98,87.25 65.25,87.25 | LED1.A 36.73,86.75 arc-90 37.23,87.25 44.75,87.25
LOAD0
  Top 0.2: JP2.16 51.27,6.25 arc90 50.77,6.75 41.5,6.75 41,7.25 30.75,7.25 arc-90 29.75,8.25 29.75,19 arc90 29.25,19.5 17.11,19.5 arc-90 16.61,20 16.61,22.5 16.5,22.61 16.5,28.05 arc-90 17,28.55 Q113.1
LOAD0A'
  Top 0.2: R47.2 19,26.5 arc-90 18.5,27 Q113.3 Q112.3 Q111.3 18.5,43.05 arc90 18,43.55 Q103.1
LOAD1  (via drill 0.3)
  Top 0.2: v53,8 52.75,8.25 44.12,8.25 arc-90 43.62,8.75 arc90 43.12,9.25 40.75,9.25 arc-90 40.25,9.75 40.25,24.25 arc90 39.88,24.62 arc-90 39.5,25 39.5,28.05 arc-90 40,28.55 Q80.1
  Bottom 0.2: v53,8 53.31,8 arc-90 53.81,7.5 JP2.17
LOAD1A'-
  Top 0.2: Q70.1 41,43.55 arc-90 41.5,43.05 Q78.3 Q79.3 Q80.3 41.5,27 arc90 42,26.5 R33.2
LOAD2  (via drill 0.3)
  Top 0.2: v56.5,11 62,11 62.1,11 arc90 62.6,11.5 62.6,22 | 62.6,22 62.6,22.5 62.5,22.61 62.5,28.05 arc-90 63,28.55 Q30.1 | 62.6,22
  Bottom 0.25: v56.5,11 56.35,10.85 JP2.18
LOAD2A'
  Top 0.2: Q12.1 64,43.55 arc-90 64.5,43.05 Q28.3 Q29.3 Q30.3 64.5,27 arc90 65,26.5 R11.2
LOAD3  (via drill 0.3)
  Top 0.2: v59,9 59.25,8.75 85.11,8.75 arc90 85.61,9.25 85.61,22 | Q146.1 86,28.55 arc90 85.5,28.05 85.5,22.61 85.61,22.5 85.61,22 | 85.61,22
  Bottom 0.25: v59,9 58.89,9.14 JP2.19
LOAD3A'
  Top 0.2: Q136.1 87,43.55 arc-90 87.5,43.05 Q144.3 Q145.3 Q146.3 87.5,26.75 arc90 88,26.25 R61.2
N$1
  Top 0.2: Q36.3 Q35.3 54,59.8 54,62 arc-90 54.5,62.5 R13.1 55,62.5 arc90 55.5,63 55.5,69.3 arc-90 56,69.8 Q50.1
N$2
  Top 0.2: Q39.3 Q38.3 60.45,62 arc90 59.95,62.5 R15.1 59.5,62.5 arc-90 59,63 59,67.45 arc90 58.5,67.95 Q40.1
N$3
  Top 0.2: Q21.3 18.5,12.75 | 18.5,12.75 18.5,13 R9.1 | SJ1.2 18.5,12.75
N$4
  Top 0.2: Q52.3 Q51.3 62.75,59.8 62.75,62 arc-90 63.25,62.5 R17.1 63.75,62.5 arc90 64.25,63 64.25,69.3 arc-90 64.75,69.8 Q66.1
N$5
  Top 0.2: 37.3,82.5 Q1.3
  Top 0.4: R1.1 39.5,80.35 arc-90 39,80.85 39,82 arc90 38.5,82.5 37.3,82.5
N$6
  Top 0.2: 45.3,82.5 Q2.3
  Top 0.4: R2.1 47.5,80.35 arc-90 47,80.85 47,82 arc90 46.5,82.5 45.3,82.5
N$7
  Top 0.2: Q55.3 Q54.3 69.25,59.8 69.25,62 arc90 68.75,62.5 R23.1 68.25,62.5 arc-90 67.75,63 67.75,67.45 arc90 67.25,67.95 Q56.1
N$8
  Top 0.2: Q85.3 Q84.3 31.05,62 arc-90 31.55,62.5 R35.1 32,62.5 arc90 32.5,63 32.5,69.3 arc-90 33,69.8 Q91.1
N$9
  Top 0.2: Q88.3 Q87.3 37.45,62 arc90 36.95,62.5 R37.1 36.5,62.5 arc-90 36,63 36,67.45 arc90 35.5,67.95 Q89.1
N$10
  Top 0.2: Q93.3 Q92.3 39.8,62 arc-90 40.3,62.5 R39.1 40.75,62.5 arc90 41.25,63 41.25,69.3 arc-90 41.75,69.8 Q99.1
N$11
  Top 0.2: Q96.3 Q95.3 46.2,62 arc90 45.7,62.5 R41.1 45.25,62.5 arc-90 44.75,63 44.75,67.45 arc90 44.25,67.95 Q97.1
N$12
  Top 0.2: Q151.3 Q150.3 77,59.8 77,60.5 77,62 arc-90 77.5,62.5 R63.1 78,62.5 arc90 78.5,63 78.5,69.3 arc-90 79,69.8 Q157.1
N$13
  Top 0.2: Q154.3 Q153.3 83.45,62 arc90 82.95,62.5 R65.1 82.5,62.5 arc-90 82,63 82,67.45 arc90 81.5,67.95 Q155.1
N$14
  Top 0.2: Q159.3 Q158.3 85.8,62 arc-90 86.3,62.5 R67.1 86.75,62.5 arc90 87.25,63 87.25,69.3 arc-90 87.75,69.8 Q165.1
N$15
  Top 0.2: Q162.3 Q161.3 92.2,62 arc90 91.7,62.5 R69.1 91.25,62.5 arc-90 90.75,63 90.75,67.45 arc90 90.25,67.95 Q163.1
N$16
  Top 0.2: Q118.3 Q117.3 8,59.8 8,62 arc-90 8.5,62.5 R49.1 9,62.5 arc90 9.5,63 9.5,69.3 arc-90 10,69.8 Q124.1
N$17
  Top 0.2: Q121.3 Q120.3 14.5,59.8 14.5,62 arc90 14,62.5 R51.1 13.5,62.5 arc-90 13,63 13,67.45 arc90 12.5,67.95 Q122.1
N$18
  Top 0.2: Q126.3 Q125.3 16.8,62 arc-90 17.3,62.5 R53.1 17.75,62.5 arc90 18.25,63 18.25,69.3 arc-90 18.75,69.8 Q132.1
N$19
  Top 0.2: Q129.3 Q128.3 23.25,59.8 23.25,62 arc90 22.75,62.5 R55.1 22.25,62.5 arc-90 21.75,63 21.75,67.45 arc90 21.25,67.95 Q130.1
N$20
  Top 0.2: 53.3,82.5 Q3.3
  Top 0.4: R3.1 55.5,80.35 arc-90 55,80.85 55,82 arc90 54.5,82.5 53.3,82.5
N$21
  Top 0.4: Q4.3 62.5,82.45 arc-90 63,81.95 63,80.85 arc90 63.5,80.35 R4.1
N$22
  Top 0.4: R4.2 64.5,84.75 arc90 64,85.25 LED4.K
N$23
  Top 0.4: R3.2 56.25,84.75 arc90 55.75,85.25 LED3.K
N$24
  Top 0.4: LED2.K 47.75,85.25 arc-90 48.25,84.75 R2.2
N$25
  Top 0.4: R1.2 40.25,84.75 arc90 39.75,85.25 LED1.K
N$100
  Top 0.2: R50.1 8.6,64.5 8.5,64.5 arc-90 8,65 8,66.95 Q119.3 Q124.3 8,70.8 8.05,70.85 Q5.3 8,74.55 8,76 arc-90 8.5,76.5 12,76.5 | Q126.1 19.25,55 16.5,55 arc-90 16,55.5 16,76 arc90 15.5,76.5 12,76.5 | Q123.1 12,71.75 12,76.5
N$101  (via drill 0.3)
  Top 0.2: 14.45,68.75 Q122.3 14.5,66.95 14.5,66.25 | 14.45,68.75 Q123.3 | 14.5,66.25 15,66.25 arc-90 15.5,65.75 15.5,58 v15.25,57.75 | v20.75,57.75 20.75,57 Q129.1 | R52.1 14,64.25 arc90 14.5,64.75 14.5,66.25 | Q119.1 10.45,66.7 arc-90 10.75,67 arc90 11.25,67.5 11.25,68.25 arc-90 11.75,68.75 14.45,68.75
  Bottom 0.2: v20.75,57.75 20.75,58.25 arc90 20.25,58.75 15.75,58.75 arc90 15.25,58.25 v15.25,57.75
N$102
  Top 0.2: 23.2,68.75 Q130.3 23.2,64.75 arc-90 22.7,64.25 R56.1 | 23.2,68.75 Q131.3 | Q127.1 19.2,66.7 arc-90 19.5,67 arc90 20,67.5 20,68.25 arc-90 20.5,68.75 23.2,68.75
N$103  (via drill 0.3)
  Top 0.2: 37.5,66.95 Q89.3 37.45,68.75 | 37.45,68.75 Q90.3 | v38.25,57.75 38.5,58 38.5,64.25 | v43.75,57.75 43.75,57 Q96.1 | 37.45,68.75 38,68.75 arc-90 38.5,68.25 38.5,64.25 | R38.1 38.5,64.25 | Q86.1 33.45,66.7 arc-90 33.75,67 arc90 34.25,67.5 34.25,68.25 arc-90 34.75,68.75 37.45,68.75
  Bottom 0.2: v43.75,57.75 43.75,58 arc90 43.25,58.5 38.75,58.5 arc90 38.25,58 v38.25,57.75
N$104
  Top 0.2: Q91.3 Q86.3 31,66.95 31,65 arc90 31.5,64.5 31.6,64.5 R36.1 | Q93.1 42.25,55 39.5,55 arc-90 39,55.5 39,76 arc90 38.5,76.5 35,76.5 | Q90.1 35,75.75 35,76.5 | 35,76.5 31.5,76.5 arc90 31,76 31,74.55 arc90 Q8.3 Q91.3 | 31,70.8 arc90 Q91.3
N$105
  Top 0.2: 46.2,68.75 Q97.3 46.25,66.95 46.25,64.75 arc-90 45.75,64.25 R42.1 | 46.2,68.75 Q98.3 | Q94.1 42.2,66.7 arc-90 42.5,67 arc90 43,67.5 43,68.25 arc-90 43.5,68.75 46.2,68.75
N$110
  Top 0.2: 69.2,68.75 Q56.3 69.2,64.75 arc-90 68.7,64.25 R24.1 | 69.2,68.75 Q57.3 | Q53.1 65.2,66.7 arc-90 65.5,67 arc90 66,67.5 66,68.25 arc-90 66.5,68.75 69.2,68.75
N$111  (via drill 0.3)
  Top 0.2: 60.5,66.95 Q40.3 60.45,68.75 | 60.45,68.75 Q41.3 | v61.25,57.75 61.5,58 61.5,64.25 | v66.75,57.75 66.75,57 Q55.1 | 60.45,68.75 61,68.75 arc-90 61.5,68.25 61.5,64.25 | R16.1 61.5,64.25 | Q37.1 56.45,66.7 arc-90 56.75,67 arc90 57.25,67.5 57.25,68.25 arc-90 57.75,68.75 60.45,68.75
  Bottom 0.2: v66.75,57.75 66.75,58.25 arc90 66.25,58.75 61.75,58.75 arc90 61.25,58.25 v61.25,57.75
N$112
  Top 0.2: 54.05,70.5 Q37.3 54,66.95 54,64.75 arc90 54.5,64.25 R14.1 | 54.05,70.5 Q50.3 arc-90 54,70.8 | Q52.1 65.25,55 62.5,55 arc-90 62,55.5 62,76 arc90 61.5,76.5 58,76.5 | 58,76.5 54.5,76.5 arc90 54,76 54,74.55 arc90 Q19.3 54.05,70.5 | 58,76.5 58,71.75 arc90 Q41.1
N$113
  Top 0.2: 92.2,68.75 Q163.3 92.25,66.95 92.25,64.75 arc-90 91.75,64.25 R70.1 | 92.2,68.75 Q164.3 | Q160.1 88.2,66.7 arc-90 88.5,67 arc90 89,67.5 89,68.25 arc-90 89.5,68.75 92.2,68.75
N$114  (via drill 0.3)
  Top 0.2: 83.5,66.95 Q155.3 83.45,68.75 | 83.45,68.75 Q156.3 | Q152.1 79.5,66.1 79.5,66.75 arc-90 79.75,67 arc90 80.25,67.5 80.25,68.25 arc-90 80.75,68.75 83.45,68.75 | v84.25,57.75 84.5,58 84.5,64.25 | v89.75,57.75 89.75,57 Q162.1 | 84.5,64.25 84.5,65.75 84.5,68.25 arc90 84,68.75 83.45,68.75 | R66.1 84.5,64.25
  Bottom 0.2: v89.75,57.75 89.75,58 arc90 89.25,58.5 84.75,58.5 arc90 84.25,58 v84.25,57.75
N$115
  Top 0.2: Q159.1 88.25,55 85.5,55 arc-90 85,55.5 85,76 arc90 84.5,76.5 81,76.5 | R64.1 77.5,64.25 arc-90 77,64.75 77,66.95 Q152.3 Q157.3 Q18.3 77.05,76 arc-90 77.55,76.5 81,76.5 | 81,76.5 81,71.75 arc90 Q156.1
NEXT0
  Top 0.2: Q110.1 12.5,28.55 12,28.55 arc90 11.5,28.05 11.5,23.61 11.61,23.5 11.61,19.5 arc90 12.11,19 16.25,19 | JP2.12 41.11,6.25 arc90 40.61,6.75 30.25,6.75 arc-90 29.25,7.75 29.25,18.5 arc90 28.75,19 16.25,19 | 15.75,19 16.25,19
NEXT0A'
  Top 0.2: Q102.1 13.45,39 Q108.3 Q109.3 Q110.3 13.5,27 arc90 14,26.5 R46.2
NEXT1  (via drill 0.3)
  Top 0.2: v43,8.25 42.5,8.75 35.75,8.75 arc-90 35.25,9.25 35.25,24.25 arc90 34.88,24.62 arc-90 34.5,25 34.5,28.05 arc-90 35,28.55 Q77.1
  Bottom 0.2: v43,8.25 43.15,8.25 arc-90 43.65,7.75 JP2.13
NEXT1A'
  Top 0.2: Q69.1 36.45,39 Q75.3 Q76.3 Q77.3 36.5,27 arc90 37,26.5 R32.2
NEXT2  (via drill 0.3)
  Top 0.2: v46,10.5 46,10.75 arc-90 46.5,11.25 54.88,11.25 arc90 55.38,11.75 55.38,12.75 arc-90 55.88,13.25 56.5,13.25 | 56.5,13.25 57,13.25 | 57,13.25 56.5,13.25 | 57,13.25 57.1,13.25 arc90 57.6,13.75 57.6,23.5 57.5,23.61 57.5,28.05 arc-90 58,28.55 Q27.1
  Bottom 0.25: v46,10.5 46,4.94 JP2.14
NEXT2A'
  Top 0.2: Q11.1 59.45,39 Q25.3 Q26.3 Q27.3 59.5,27 arc90 60,26.5 R8.2
NEXT3  (via drill 0.3)
  Top 0.2: v49,10 arc90 49.25,9.75 59.5,9.75 60,9.25 80.11,9.25 arc90 80.61,9.75 80.61,23 | Q143.1 81,28.55 arc90 80.5,28.05 80.5,23.61 80.61,23.5 80.61,23 | 80.61,23
  Bottom 0.25: v49,10 48.73,9.98 JP2.15
NEXT3A'
  Top 0.2: Q135.1 82.45,39 Q141.3 Q142.3 Q143.3 82.5,26.75 arc90 83,26.25 R60.2
OP1  (via drill 0.3)
  Top 0.2: Q15.1 53.5,32.55 52.5,32.55 arc90 52,32.05 52,25.5 arc90 52.5,25 52.75,25 arc-90 53.25,24.5 v53.25,23.25 | Q109.1 12.5,32.55 11.5,32.55 arc90 11,32.05 v11,23.25 | Q106.1 6.5,32.55 arc90 6,32.05 6,24.75 arc90 6.5,24.25 7,24.25 arc-90 7.5,23.75 v7.5,23.25 | Q73.1 29.5,32.55 arc90 29,32.05 29,25 29,24.67 29,24.5 v30.25,23.25 | Q76.1 34.5,32.55 arc90 34,32.05 v34,23.25 | Q26.1 57.5,32.55 arc90 57,32.05 v57,23.25 | Q139.1 75.5,32.55 arc90 75,32.05 75,23.75 arc90 75.5,23.25 v76.25,23.25 | Q142.1 80.5,32.55 arc90 80,32.05 v80,23.25 | JP2.2 15.71,7 arc-90 16.21,7.5 20.5,7.5 | Q22.1 21.8,8.25 21.8,8 arc-90 21.3,7.5 20.5,7.5 | v4.75,23.25 4.75,17.5 arc90 5.25,17 20,17 arc-90 20.5,16.5 20.5,7.5
  Bottom 0.25: v4.75,23.25 v7.5,23.25 8.5,23.25 v11,23.25 v30.25,23.25 v34,23.25 v53.25,23.25 v57,23.25 v76.25,23.25 v80,23.25
OP2  (via drill 0.3)
  Top 0.2: Q14.1 53.51,36.55 52,36.55 arc90 51.5,36.05 51.5,24.61 51.6,24.5 51.6,24 | Q72.1 30.5,36.55 29,36.55 arc90 28.5,36.05 28.5,24.61 28.61,24.5 28.61,21.64 arc90 v29,21.25 | Q78.1 40.5,36.55 39,36.55 arc90 38.5,36.05 38.5,22.61 38.4,22.5 38.4,21.75 arc-90 37.9,21.25 v37.75,21.25 | 5.5,25.75 5.5,25.5 | Q111.1 17.5,36.55 16,36.55 arc90 15.5,36.05 15.5,22.61 15.39,22.5 15.39,21.64 arc-90 15,21.25 v14.75,21.25 | Q105.1 6,36.55 arc90 5.5,36.05 5.5,25.75 | Q28.1 62,36.55 arc90 61.5,36.05 61.5,22.61 61.4,22.5 61.4,21.75 arc-90 60.9,21.25 v60.75,21.25 | Q138.1 75,36.55 arc90 74.5,36.05 74.5,21.75 arc90 v75,21.25 | Q144.1 85,36.55 arc90 84.5,36.05 84.5,22.61 84.39,22.5 84.39,22 | JP2.3 18.25,6.5 arc-90 18.75,7 24.75,7 | Q23.1 26.05,8.25 26.05,7.5 arc-90 25.55,7 24.75,7 | 24.75,7 24.75,17.5 arc90 24.25,18 7.5,18 arc-90 7,18.5 v7,21.25 7,22.75 arc90 6.5,23.25 6,23.25 arc-90 5.5,23.75 5.5,25.75 | 84.39,22 | 84.39,22 84.39,21.75 arc-90 83.89,21.25 v83.75,21.25 | 51.6,24 | 51.6,24 51.6,21.64 arc90 v52,21.25
  Bottom 0.25: v7,21.25 v14.75,21.25 v29,21.25 v37.75,21.25 v52,21.25 v60.75,21.25 v75,21.25 v83.75,21.25
OUT0  (via drill 0.3)
  Top 0.2: 16.8,70.5 Q127.3 16.75,66.95 16.75,65.75 arc90 17,65.5 arc-90 17.35,65.15 R54.1 | 16.8,70.5 Q132.3 16.75,70.8 | 36.25,80 Q1.1 24.75,80.05 arc90 24.25,79.55 v24.25,78.25 | 16.8,70.5 Q6.3 16.75,74.55 16.75,76 arc-90 17.25,76.5 20.75,76.5 | v24.25,76.25 arc90 24,76.5 23.75,76.5 | 20.75,76.5 23.75,76.5 | Q131.1 arc-90 20.75,71.75 20.75,76.5 | 23.75,76.5 24.75,76.5 arc-90 25.25,76 25.25,21 arc90 25.75,20.5 30.25,20.5 arc-90 30.75,20 30.75,9.25 arc90 31.75,8.25 42,8.25 42.61,7.64 43.25,7.64 43.36,7.75 52,7.75 52.5,7.25 61.75,7.25 arc-90 62.25,6.75 arc90 62.75,6.25 71.09,6.25 arc-90 71.59,5.75 JP2.24
  Bottom 0.2: v24.25,78.25 v24.25,76.25
OUT1  (via drill 0.3)
  Top 0.2: 53.75,9.25 53.25,9.25 | 48.25,25.5 48.25,25.75 | Q98.1 43.8,76.45 43.75,76.5 | 48.25,25.75 48.25,12.75 arc-90 47.75,12.25 42.75,12.25 arc90 42.25,11.75 42.25,10.75 arc90 42.75,10.25 44.12,10.25 arc-90 44.62,9.75 arc90 45.12,9.25 53.25,9.25 | R40.1 40.25,64.25 arc-90 39.75,64.75 39.75,66.95 Q94.3 Q99.3 Q7.3 39.8,76 arc-90 40.3,76.5 43.75,76.5 | Q2.1 44.3,79.25 arc90 45.3,78.25 v47,78.25 | 48.25,25.75 48.25,75.25 | 48.25,75.25 48.25,75.38 | JP2.25 74.13,6.25 arc90 73.63,6.75 65.5,6.75 arc-90 65,7.25 65,7.75 arc90 64.5,8.25 58.5,8.25 57.5,8.25 arc-90 57,8.75 arc90 56.5,9.25 53.25,9.25 | 43.75,76.5 46.75,76.5 arc-90 v47,76.25 47.75,76.25 arc-90 48.25,75.75 48.25,75.25
  Bottom 0.2: v47,78.25 v47,76.25
OUT2  (via drill 0.3)
  Top 0.2: 71.25,25.52 71.25,25.25 | 62.75,76.25 v62.88,76.38 | v62.88,76.38 63,76.5 65.5,76.5 66.3,76.5 arc-90 66.8,76 66.8,75 66.8,73 | Q57.1 66.8,73 | v76.5,10.75 76,10.75 71.75,10.75 arc-90 71.25,11.25 71.25,25.25 | R18.1 63.3,64.25 arc-90 62.8,64.75 Q53.3 Q66.3 Q20.3 62.8,76.3 arc-90 v62.88,76.38 | v62,78.25 52.8,78.25 arc-90 52.3,78.75 Q3.1 | 66.8,73 69.75,73 70.75,73 arc-90 71.25,72.5 71.25,25.25
  Bottom 0.2: v62.88,76.38 62.75,76.5 v62.88,76.38 | v62,78.25 62.38,78.25 arc-90 62.88,77.75 v62.88,76.38
  Bottom 0.25: v76.5,10.75 76.5,4.92 JP2.26
OUT3  (via drill 0.3)
  Top 0.2: 85.8,70.5 Q160.3 85.8,64.75 arc90 86.3,64.25 R68.1 | 85.8,70.5 Q165.3 | 89.75,76.5 v86,76.5 85.75,76.25 85.75,74.55 arc90 Q17.3 85.8,70.5 | 89.75,76.5 92.75,76.5 93.75,76.5 arc-90 94.25,76 94.25,18.25 arc-90 93.75,17.75 87.75,17.75 arc90 87.25,17.25 87.25,8 arc-90 86.75,7.5 79.71,7.5 arc90 79.21,7 JP2.27 | 60.3,80 Q4.1 60.3,79.5 arc90 60.8,79 85.5,79 arc-90 86,78.5 v86,78.25 | Q164.1 89.8,76.45 arc90 89.75,76.5
  Bottom 0.2: v86,78.25 v86,76.5
PREV0
  Top 0.2: Q107.1 7,28.55 arc90 6.5,28.05 6.5,25.5 arc90 7,25 8,25 arc-90 8.5,24.5 8.5,19 arc90 9,18.5 28.25,18.5 arc-90 28.75,18 28.75,7.25 arc90 29.75,6.25 30.25,6.25 arc-90 30.95,5.55 JP2.8
PREV0A'
  Top 0.2: R45.2 9,26.5 arc-90 8.5,27 Q107.3 Q106.3 Q105.3 8.5,43.05 arc-90 9,43.55 Q101.1
PREV1  (via drill 0.3)
  Top 0.2: Q74.1 30,28.55 arc90 29.5,28.05 29.5,26 31.5,24 31.5,10 arc90 32.5,9 v32.75,9
  Bottom 0.2: JP2.9 33.49,8.5 arc90 32.99,9 v32.75,9
PREV1A'
  Top 0.2: R31.2 32,26.5 arc-90 31.5,27 Q74.3 Q73.3 Q72.3 31.5,43.05 arc-90 32,43.55 Q68.1
PREV2  (via drill 0.3)  (1 unrouted)
  Top 0.2: v43,11 43,11.25 arc-90 43.5,11.75 54,11.75 arc90 54.5,12.25 54.5,23.25 | 54.5,23.25 54.5,24 | Q16.1 53,28.55 arc90 52.5,28.05 52.5,26.5 | 52.5,26.5 52.5,26 | 54.5,23.25 54.5,25 arc90 54,25.5 53,25.5 arc-90 52.5,26 | 52.5,26 52.5,26.5
  Bottom 0.2: v43,11 36.53,11 arc90 36.03,10.5 JP2.10
PREV2A'
  Top 0.2: Q10.1 54.8,43.55 54.5,43.25 Q14.3 Q15.3 Q16.3 54.5,27 arc90 55,26.5 R7.2
PREV3  (via drill 0.3)
  Top 0.2: Q140.1 76,28.55 arc90 75.5,28.05 75.5,24.5 arc90 76,24 76.75,24 arc-90 77.25,23.5 77.25,10.25 arc-90 76.75,9.75 60.5,9.75 60,10.25 50,10.25 arc-90 49.75,10.5 arc90 49.5,10.75 48.25,10.75 arc90 47.75,10.25 arc-90 47.25,9.75 45.5,9.75 arc-90 45,10.25 45,10.5 arc90 44.5,11 v44,11
  Bottom 0.2: v44,11 44,10.5 arc-90 43.5,10 39.07,10 arc90 38.57,9.5 JP2.11
PREV3A'
  Top 0.2: 77.5,38.75 Q139.3 Q140.3 77.5,26.75 arc90 78,26.25 R59.2 | 77.5,38.75 Q138.3 77.5,43.25 77.8,43.55 Q134.1 78,43.55 arc90 77.5,43.05 77.5,38.75
R0A-
  Top 0.2: 13.25,50.4 R43.2 | Q100.3 12.7,49.9 arc-90 13.2,50.4 13.25,50.4 | Q121.1 12.75,56.95 arc-90 13.25,56.45 13.25,50.4
R1A
  Top 0.2: R25.2 36.25,50.4 36.2,50.4 | Q67.3 35.7,49.9 arc-90 36.2,50.4 | 35.75,56.95 35.25,56.95 Q88.1 35.7,56.95 arc-90 36.2,56.45 36.2,50.4
R2A
  Top 0.2: 59.25,50.4 R5.2 | 59.25,56.25 59.25,56 | 59.25,56 59.25,55 | 59.25,55 59.25,50.4 | Q9.3 58.7,49.9 arc-90 59.2,50.4 59.25,50.4 | 58.75,56.95 arc-90 59.25,56.45 | 59.25,56.45 59.25,56 | 59.25,56 59.25,55 | Q39.1 58.75,56.95 | 58.75,56.95 arc-90 59.25,56.45 | 59.25,56.45 59.25,56
R3A
  Top 0.2: 82.25,50.4 82.15,50.4 arc90 81.7,49.95 Q133.3 | 82.25,50.4 R57.2 | Q154.1 81.75,56.95 arc-90 82.25,56.45 82.25,50.4
S0A-  (5 unrouted)
  Top 0.2: Q101.3 8.25,44.5 | 8.25,44.5 9.5,44.5 Q102.3 Q103.3 Q104.3 21.75,44.5 arc90 22.25,45 22.25,46.75 arc90 21.75,47.25 R44.2 | 9.5,50.5 9.55,50.45 Q100.1 arc90 10.25,50.5 8.25,50.5 | 8.25,46 8.25,45.25 | 8.25,45.25 8.25,44.5 | Q118.1 10.5,55 10.5,53.25 arc-90 10,52.75 9.5,52.75 8.75,52.75 arc90 8.25,52.25 8.25,50.5 | 8.25,45.25 8.25,50.5
S1A
  Top 0.2: Q68.3 31.25,44.5 | 31.25,44.5 32.5,44.5 Q69.3 Q70.3 Q71.3 44.75,44.5 arc90 45.25,45 45.25,46.75 arc90 44.75,47.25 R26.2 | 33.5,55 Q85.1 33.45,54 arc-90 32.95,53.5 31.75,53.5 arc90 31.25,53 31.25,50.5 | 31.25,44.5 31.25,50.5 | Q67.1 31.3,50.45 arc-90 31.25,50.5
S2A  (2 unrouted)
  Top 0.2: Q10.3 54.25,44.5 | 54.25,44.5 55.5,44.5 Q11.3 Q12.3 Q13.3 67.75,44.5 arc90 68.25,45 68.25,46.75 arc90 67.75,47.25 R6.2 | 54.25,46 54.25,44.5 | Q36.1 56.5,55 | 56.5,55 56.5,54.5 | 54.25,44.5 54.25,50.5 | 54.25,50.5 54.25,53 arc-90 54.75,53.5 56,53.5 arc90 56.5,54 56.5,55 | Q9.1 54.3,50.45 arc-90 54.25,50.5
S3A
  Top 0.2: Q134.3 77.25,44.5 | 77.25,44.5 78.5,44.5 Q135.3 Q136.3 Q137.3 90.75,44.5 arc90 91.25,45 91.25,46.75 arc90 90.75,47.25 R58.2 | 79.5,55 Q151.1 79.45,54 arc-90 78.95,53.5 77.75,53.5 arc90 77.25,53 77.25,50.25 | 77.25,44.5 77.25,50.25 | Q133.1 77.45,50.45 arc90 77.25,50.25
VCC  (via drill 0.3)
  Top 0.2: C4.1 v75.25,47.5 | v76.5,27.25 76.6,26.9 R59.1 | v81.5,27.25 81.6,25.9 R60.1 | v86.5,27.25 86.6,26.9 R61.1 | v91.5,27.25 91.6,26.4 R62.1 | 80.25,64.25 v80.25,63.38 80.25,62.5 | 80.25,64.25 R66.2 | 80.25,64.25 R64.2 | 80.25,62.5 R65.2 | 80.25,62.5 R63.2 | 89,64.25 v89,63.38 89,62.5 | 89,64.25 R70.2 | 89,64.25 R68.2 | 89,62.5 R69.2 | 89,62.5 R67.2 | R57.1 85,48.6 | 85,48.6 v85,51 | v53.5,27.5 53.6,26.65 R7.1 | v58.5,27.5 58.6,26.65 R8.1 | v63.5,27.5 63.6,26.4 R11.1 | v68.5,27.5 68.6,26.65 R12.1 | 57.25,64.25 v57.25,63.38 57.25,62.5 | 57.25,64.25 R16.2 | 57.25,64.25 R14.2 | 57.25,62.5 R15.2 | 57.25,62.5 R13.2 | 66,64.25 v66,63.38 66,62.5 | 66,64.25 R24.2 | 66,64.25 R18.2 | 66,62.5 R23.2 | 66,62.5 R17.2 | R5.1 62,48.6 | v62,50.25 62,48.6 | 34.25,64.25 v34.25,63.38 34.25,62.5 | 34.25,64.25 R38.2 | 34.25,64.25 R36.2 | 34.25,62.5 R37.2 | 34.25,62.5 R35.2 | 43,64.25 v43,63.38 43,62.5 | 43,64.25 R42.2 | 43,64.25 R40.2 | 43,62.5 R41.2 | 43,62.5 R39.2 | R25.1 39,48.6 | 39,48.6 v39,50.25 | v30.5,27.5 30.5,26.6 R31.1 | v35.5,27.5 35.5,26.6 R32.1 35.6,25.15 arc90 36,24.75 arc-90 36.25,24.5 v36.25,15.75 | v40.5,27.5 40.5,26.6 R33.1 | v45.5,27.5 45.5,26.6 R34.1 | 11.25,64.25 v11.25,63.38 11.25,62.5 | 11.25,64.25 R52.2 | 11.25,64.25 R50.2 | 11.25,62.5 R51.2 | 11.25,62.5 R49.2 | 20,64.25 v20,63.38 20,62.5 | 20,64.25 R56.2 | 20,64.25 R54.2 | 20,62.5 R55.2 | 20,62.5 R53.2 | R43.1 16,48.6 | 16,48.6 v16,50.25 | v7.5,27.5 7.5,26.6 R45.1 | v12.5,27.5 12.5,26.6 R46.1 | v17.5,27.5 17.5,26.6 R47.1 | v22.5,27.5 22.5,26.6 R48.1 | R58.1 88.35,48.1 arc90 87.85,48.6 85,48.6 | R6.1 65.35,48.1 arc90 64.85,48.6 62,48.6 | R26.1 42.35,48.1 arc90 41.85,48.6 39,48.6 | R44.1 19.35,48.1 arc90 18.85,48.6 16,48.6 | R19.2 26.35,16.15 arc-90 v26,16.25
  Top 0.2: v21.75,16.25 arc90 21.85,16.15 R10.2 | v17.5,16.25 18.65,16.25 arc-90 R9.2
  Top 0.4: v13.75,77.25 v36.75,77.25 v59.75,77.25 v82.75,77.25 97,77.25 arc-90 98,76.25 98,14 | JP2.29 84.29,4.25 arc90 85.29,3.25 89.5,3.25 arc90 90,3.75 90,11.5 arc-90 90.5,12 97.5,12 arc90 98,12.5 98,14 | C5.1 98,14
  Top 0.5: C3.1 v52.25,47.5 | C2.1 v29.25,47.5 | C1.1 v6.25,47.5
  Bottom 0.2: v17.5,16.25 v21.75,16.25 v26,16.25 v36.25,15.75
  Bottom 0.4: v76.5,27.25 v81.5,27.25 | v81.5,27.25 v86.5,27.25 v91.5,27.25 | v80.25,63.38 82.75,63.38 | 82.75,63.38 v89,63.38 | 82.75,63.38 82.75,51 | v85,51 82.75,51 | v53.5,27.5 v58.5,27.5 | v58.5,27.5 v63.5,27.5 v68.5,27.5 | v57.25,63.38 59.75,63.38 | 59.75,63.38 v66,63.38 | 59.75,63.38 59.75,50.25 | v62,50.25 59.75,50.25 | v30.5,27.5 v35.5,27.5 | v35.5,27.5 v40.5,27.5 v45.5,27.5 | v34.25,63.38 36.75,63.38 | 36.75,63.38 v43,63.38 | 36.75,63.38 36.75,50.25 | v39,50.25 36.75,50.25 | v7.5,27.5 v12.5,27.5 | v12.5,27.5 v17.5,27.5 v22.5,27.5 | v11.25,63.38 13.75,63.38 | 13.75,63.38 v20,63.38 | 13.75,63.38 13.75,50.25 | v16,50.25 13.75,50.25 | 13.75,63.38 v13.75,77.25 | 36.75,63.38 v36.75,77.25 | 59.75,63.38 v59.75,77.25 | 82.75,63.38 v82.75,77.25 | v6.25,47.5 12.5,47.5 | v29.25,47.5 35.5,47.5 | v52.25,47.5 58.5,47.5 | v75.25,47.5 81.5,47.5 | v12.5,27.5 12.5,47.5 | 12.5,47.5 13.25,47.5 arc90 13.75,48 13.75,50.25 | v35.5,27.5 35.5,47.5 | 35.5,47.5 36.25,47.5 arc90 36.75,48 36.75,50.25 | v58.5,27.5 58.5,47.5 | 58.5,47.5 59.25,47.5 arc90 59.75,48 59.75,50.25 | v81.5,27.25 81.5,47.5 | 81.5,47.5 82.25,47.5 arc90 82.75,48 82.75,51

## Text on the board
tPlace: A | B | /CLK | CLK
bPlace: SmallRoomLabs | Universal / shiftregister / rev1 | Prev3..0 | Next3..0 | Load3..0 | Aux3..0 | Out3..0 | Clk | /Clk | Op1 | /Op1 | Op2 | /Op2 | Clr
Reference: 136T 60R 5C